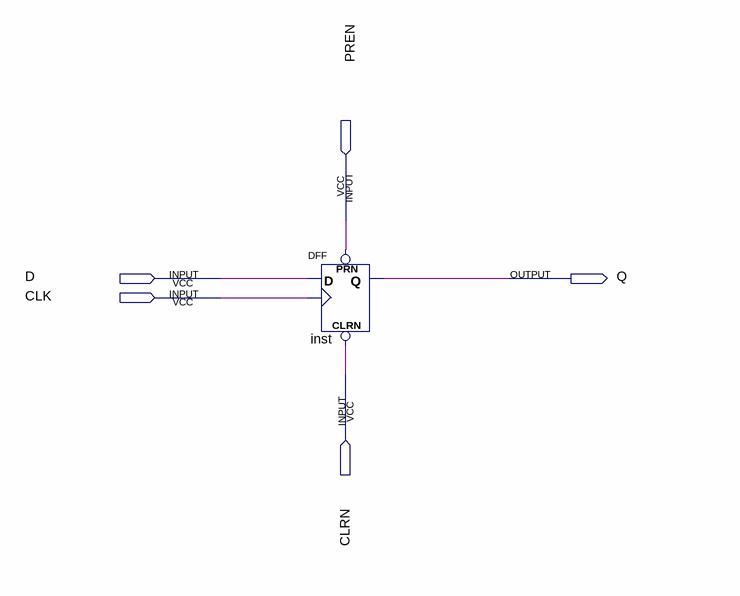
[diagram p0: schematic sheet]
// Quartus schematic dflipflop.bdf as structural Verilog: 1 symbols, 5 pins
module dflipflop (
  input  PREN,
  input  D,
  input  CLK,
  input  CLRN,
  output Q
);

  DFF inst (.CLRN(CLRN), .CLK(CLK), .D(D), .PRN(PREN), .Q(Q));
endmodule
